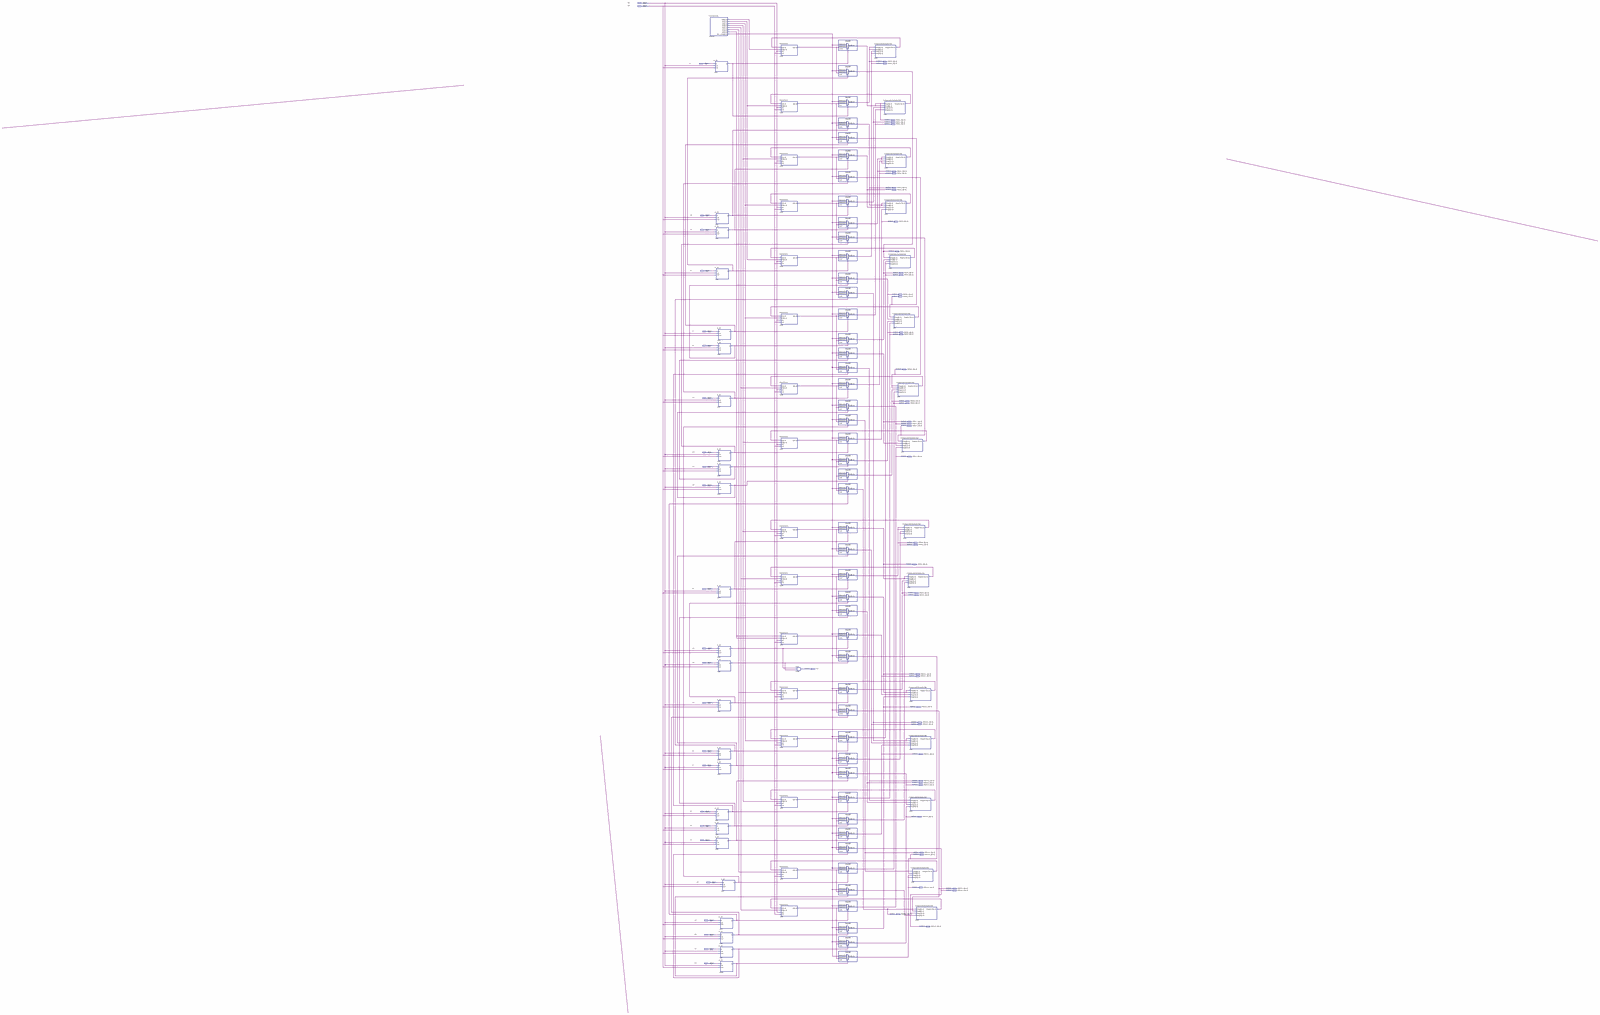
[diagram p0: schematic sheet, whole]
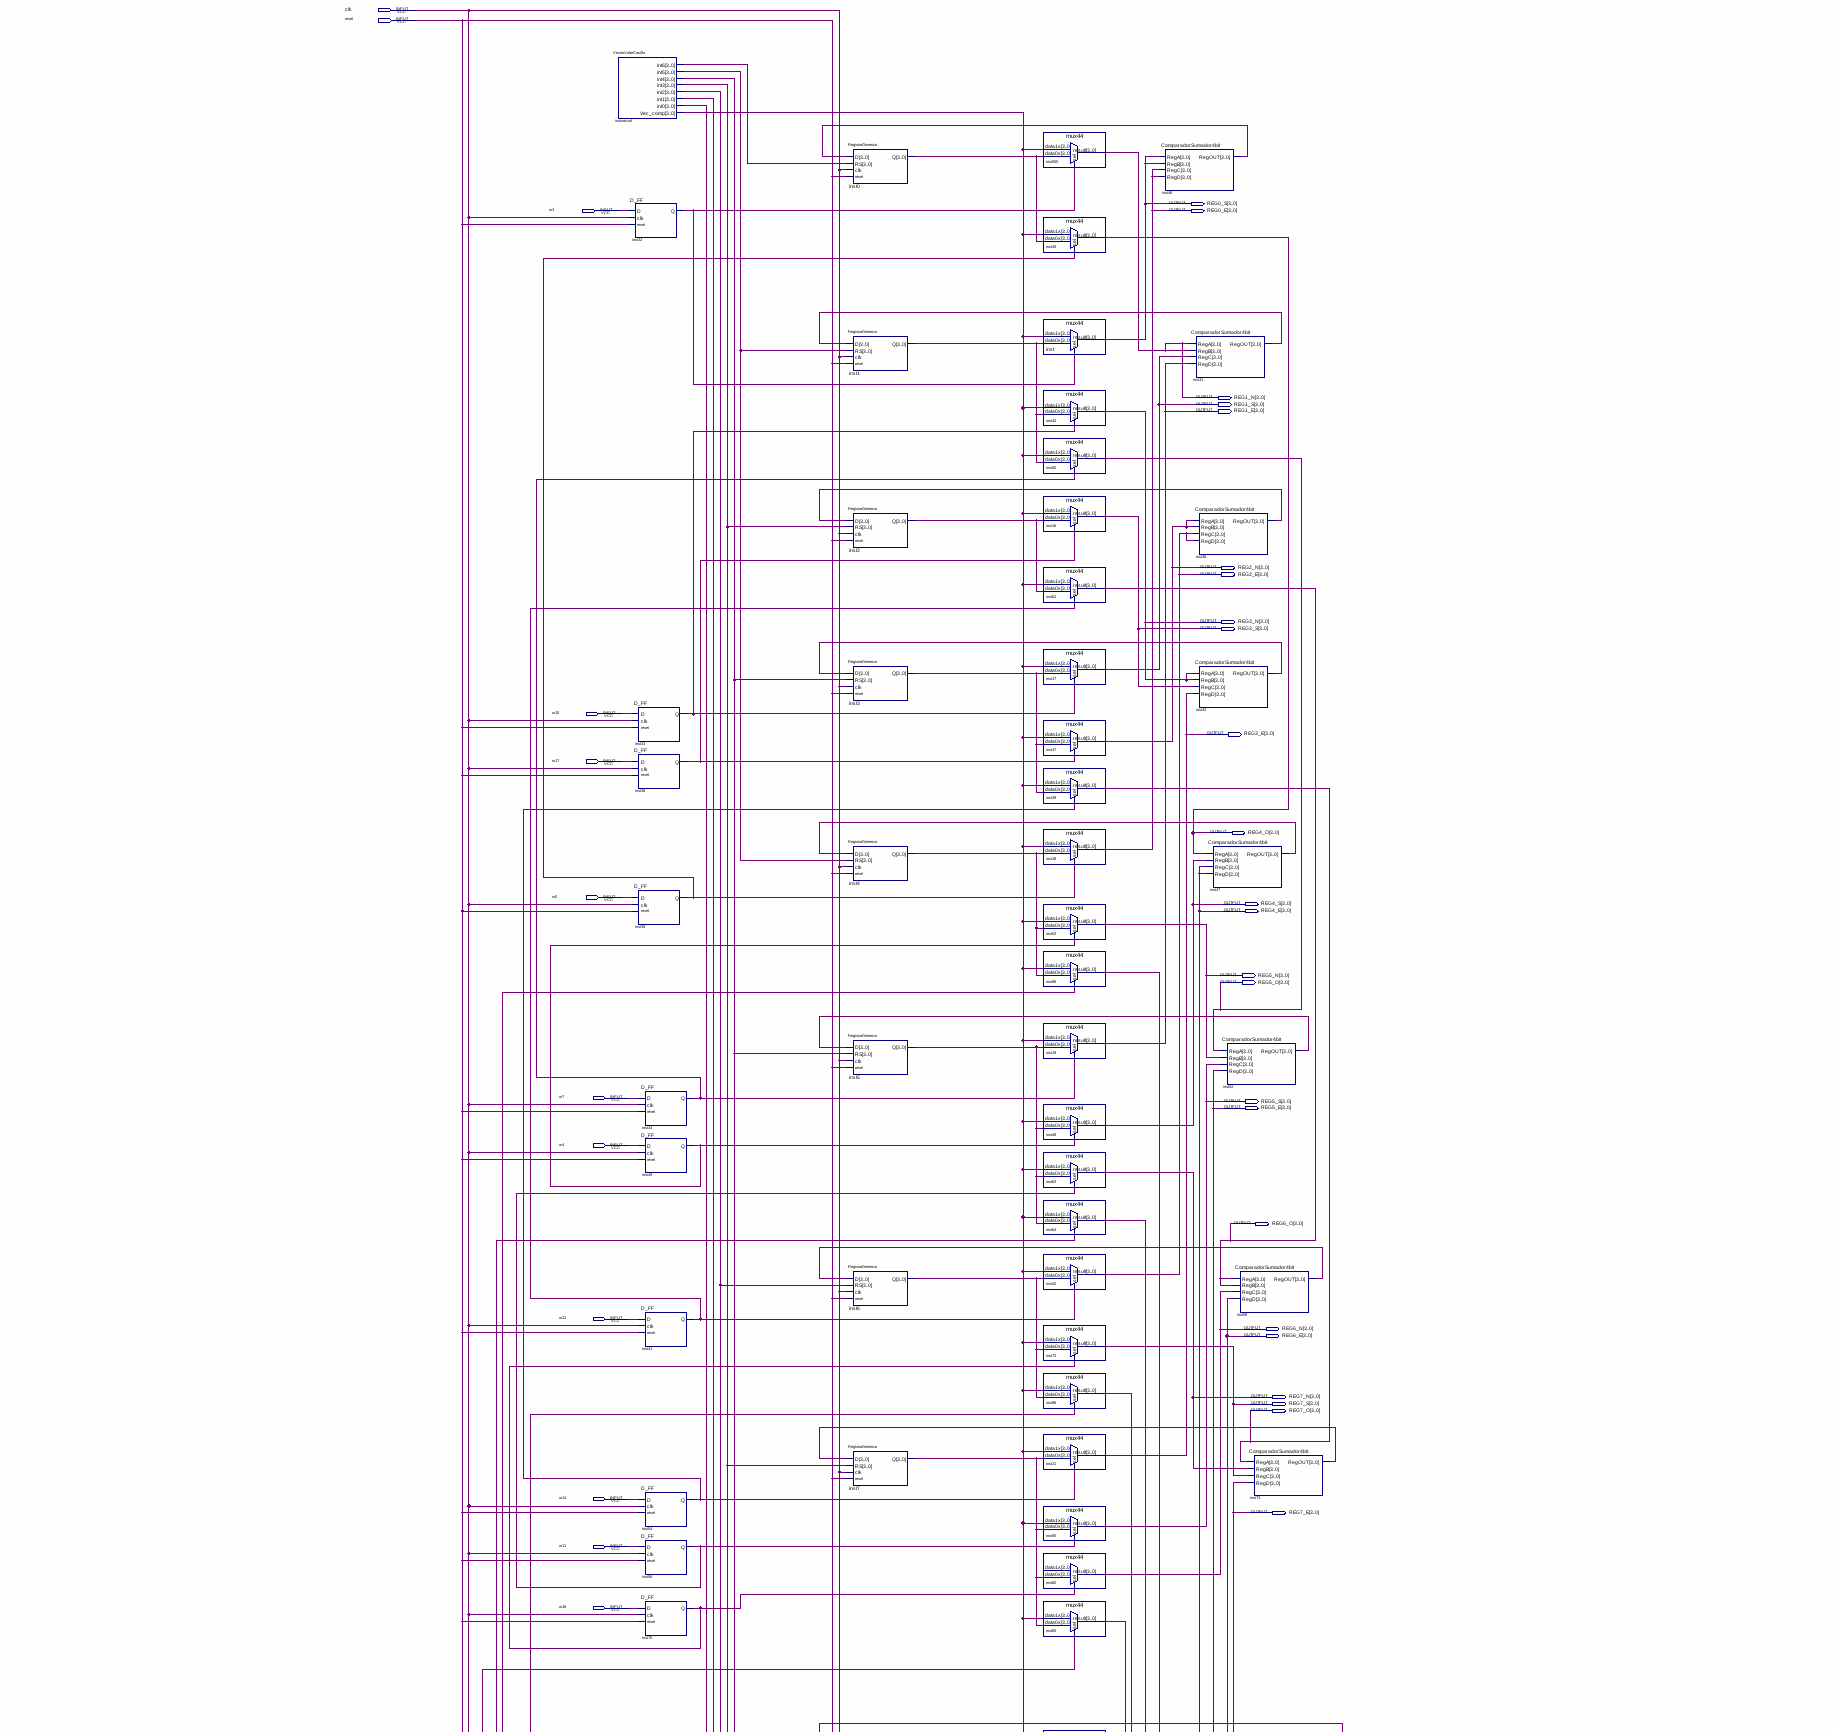
[diagram p1: schematic sheet, upper centre part]
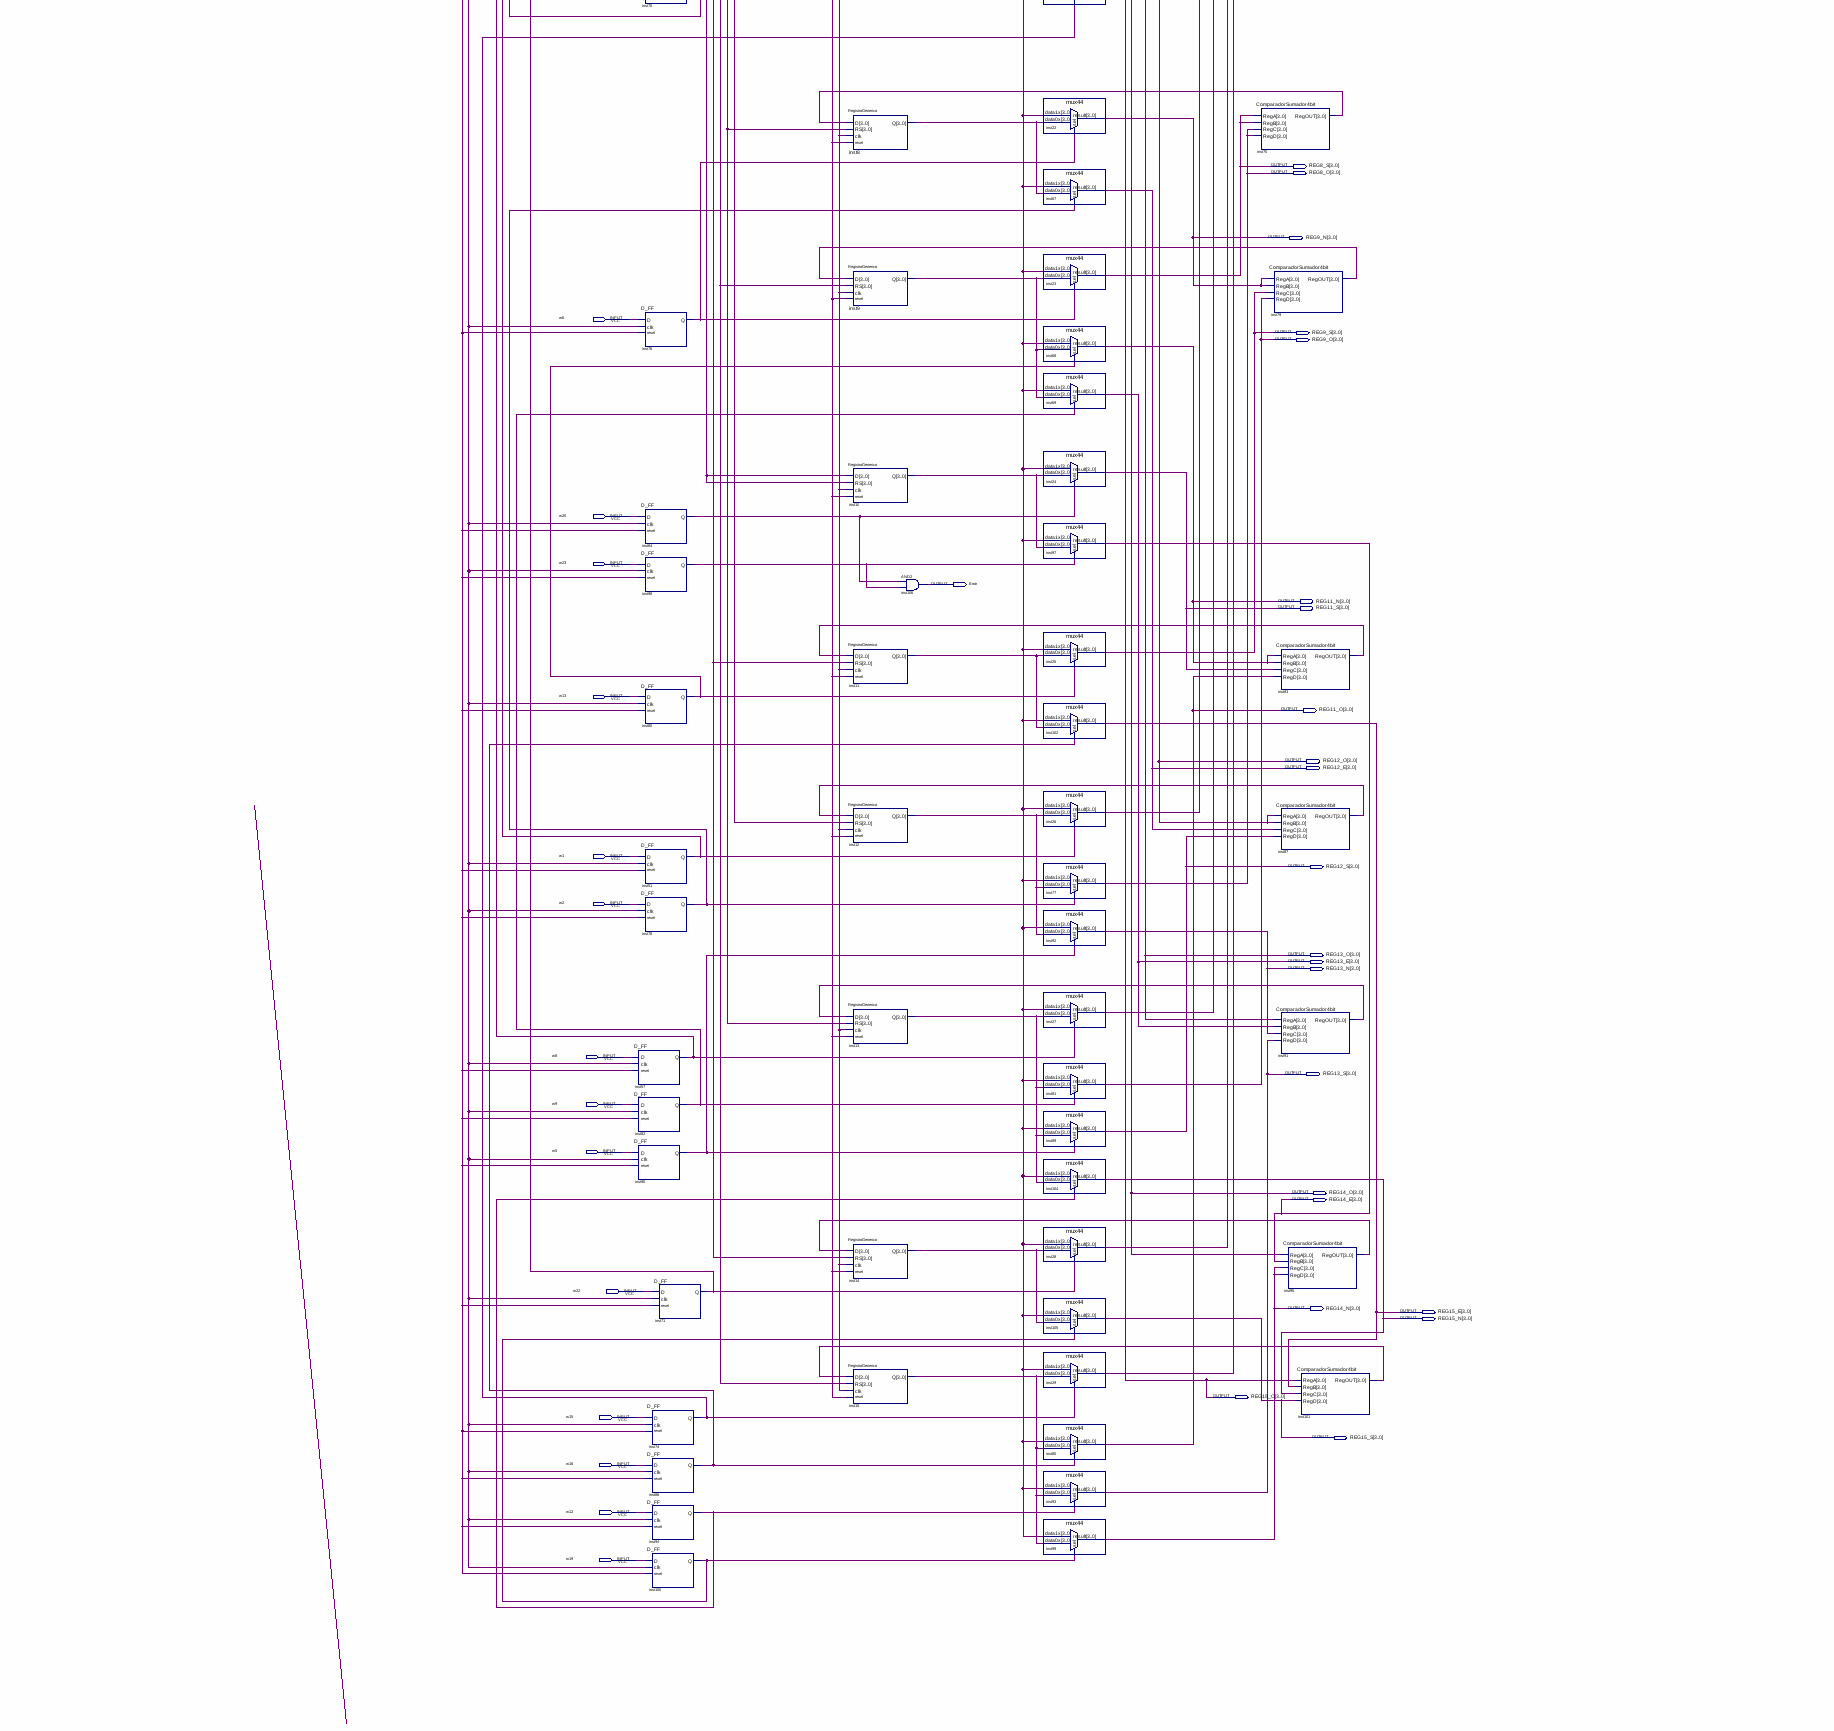
[diagram p2: schematic sheet, lower centre part]
// Quartus schematic testBlock.bdf as structural Verilog: 103 symbols, 73 pins
module testBlock (
  input  clk,
  input  reset,
  input  w3,
  input  w10,
  input  w17,
  input  w0,
  input  w7,
  input  w4,
  input  w21,
  input  w14,
  input  w11,
  input  w18,
  input  w6,
  input  w20,
  input  w23,
  input  w13,
  input  w1,
  input  w2,
  input  w8,
  input  w9,
  input  w5,
  input  w22,
  input  w15,
  input  w16,
  input  w12,
  input  w19,
  output [3:0] REG0_S,
  output [3:0] REG0_E,
  output [3:0] REG1_N,
  output [3:0] REG1_S,
  output [3:0] REG1_E,
  output [3:0] REG2_N,
  output [3:0] REG2_E,
  output [3:0] REG3_N,
  output [3:0] REG3_S,
  output [3:0] REG3_E,
  output [3:0] REG4_O,
  output [3:0] REG4_S,
  output [3:0] REG4_E,
  output [3:0] REG5_N,
  output [3:0] REG5_O,
  output [3:0] REG5_S,
  output [3:0] REG5_E,
  output [3:0] REG6_O,
  output [3:0] REG6_N,
  output [3:0] REG6_E,
  output [3:0] REG7_N,
  output [3:0] REG7_S,
  output [3:0] REG7_O,
  output [3:0] REG7_E,
  output [3:0] REG8_S,
  output [3:0] REG8_O,
  output [3:0] REG9_N,
  output [3:0] REG9_S,
  output [3:0] REG9_O,
  output Error,
  output [3:0] REG11_N,
  output [3:0] REG11_S,
  output [3:0] REG11_O,
  output [3:0] REG12_O,
  output [3:0] REG12_E,
  output [3:0] REG12_S,
  output [3:0] REG13_O,
  output [3:0] REG13_E,
  output [3:0] REG13_N,
  output [3:0] REG13_S,
  output [3:0] REG14_O,
  output [3:0] REG14_E,
  output [3:0] REG14_N,
  output [3:0] REG15_E,
  output [3:0] REG15_N,
  output [3:0] REG15_O,
  output [3:0] REG15_S
);

  wire inst32_q, inst33_q, inst34_q, inst35_q, inst38_q, inst41_q, inst49_q, inst51_q, inst54_q, inst56_q,
       inst57_q, inst70_q, inst71_q, inst74_q, inst76_q, inst78_q, inst80_q, inst82_q, inst84_q, inst86_q,
       inst90_q, inst94_q, inst98_q, inst100_q;
  wire [3:0] inst0_q, inst1_q, inst2_q, inst3_q, inst4_q, inst5_q, inst6_q, inst7_q, inst8_q, inst9_q,
       inst10_q, inst11_q, inst12_q, inst13_q, inst14_q, inst15_q, inst31_regout, inst36_regout,
       inst42_regout, inst46_regout, inst47_regout, inst52_regout, inst59_regout, inst73_regout,
       inst75_regout, inst79_regout, inst83_regout, inst87_regout, inst91_regout, inst95_regout,
       inst101_regout, instvecval_int0, instvecval_int1, instvecval_int2, instvecval_int3, instvecval_int4,
       instvecval_int5, instvecval_int6, instvecval_vec_comp;

  VectorValorCasilla instvecval (
    .int6(instvecval_int6), .int5(instvecval_int5), .int4(instvecval_int4), .int3(instvecval_int3),
    .int2(instvecval_int2), .int1(instvecval_int1), .int0(instvecval_int0), .Vec_comp(instvecval_vec_comp));
  D_FF inst32 (.D(w3), .clk(clk), .reset(reset), .Q(inst32_q));
  D_FF inst33 (.D(w10), .clk(clk), .reset(reset), .Q(inst33_q));
  D_FF inst38 (.D(w17), .clk(clk), .reset(reset), .Q(inst38_q));
  D_FF inst35 (.D(w0), .clk(clk), .reset(reset), .Q(inst35_q));
  D_FF inst34 (.D(w7), .clk(clk), .reset(reset), .Q(inst34_q));
  D_FF inst49 (.D(w4), .clk(clk), .reset(reset), .Q(inst49_q));
  D_FF inst41 (.D(w21), .clk(clk), .reset(reset), .Q(inst41_q));
  D_FF inst54 (.D(w14), .clk(clk), .reset(reset), .Q(inst54_q));
  D_FF inst56 (.D(w11), .clk(clk), .reset(reset), .Q(inst56_q));
  D_FF inst70 (.D(w18), .clk(clk), .reset(reset), .Q(inst70_q));
  D_FF inst76 (.D(w6), .clk(clk), .reset(reset), .Q(inst76_q));
  D_FF inst84 (.D(w20), .clk(clk), .reset(reset), .Q(inst84_q));
  D_FF inst98 (.D(w23), .clk(clk), .reset(reset), .Q(inst98_q));
  D_FF inst80 (.D(w13), .clk(clk), .reset(reset), .Q(inst80_q));
  D_FF inst51 (.D(w1), .clk(clk), .reset(reset), .Q(inst51_q));
  D_FF inst78 (.D(w2), .clk(clk), .reset(reset), .Q(inst78_q));
  D_FF inst57 (.D(w8), .clk(clk), .reset(reset), .Q(inst57_q));
  D_FF inst82 (.D(w9), .clk(clk), .reset(reset), .Q(inst82_q));
  D_FF inst90 (.D(w5), .clk(clk), .reset(reset), .Q(inst90_q));
  D_FF inst71 (.D(w22), .clk(clk), .reset(reset), .Q(inst71_q));
  D_FF inst74 (.D(w15), .clk(clk), .reset(reset), .Q(inst74_q));
  D_FF inst86 (.D(w16), .clk(clk), .reset(reset), .Q(inst86_q));
  D_FF inst94 (.D(w12), .clk(clk), .reset(reset), .Q(inst94_q));
  D_FF inst100 (.D(w19), .clk(clk), .reset(reset), .Q(inst100_q));
  RegistroGenerico inst0 (.D(inst46_regout), .RS(instvecval_int6), .clk(clk), .reset(reset), .Q(inst0_q));
  RegistroGenerico inst1 (.D(inst31_regout), .RS(instvecval_int5), .clk(clk), .reset(reset), .Q(inst1_q));
  RegistroGenerico inst2 (.D(inst36_regout), .RS(instvecval_int3), .clk(clk), .reset(reset), .Q(inst2_q));
  RegistroGenerico inst3 (.D(inst42_regout), .RS(instvecval_int4), .clk(clk), .reset(reset), .Q(inst3_q));
  RegistroGenerico inst4 (.D(inst47_regout), .RS(instvecval_int5), .clk(clk), .reset(reset), .Q(inst4_q));
  RegistroGenerico inst5 (.D(inst52_regout), .RS(instvecval_int4), .clk(clk), .reset(reset), .Q(inst5_q));
  RegistroGenerico inst6 (.D(inst59_regout), .RS(instvecval_int2), .clk(clk), .reset(reset), .Q(inst6_q));
  RegistroGenerico inst7 (.D(inst73_regout), .RS(instvecval_int3), .clk(clk), .reset(reset), .Q(inst7_q));
  RegistroGenerico inst8 (.D(inst75_regout), .RS(instvecval_int3), .clk(clk), .reset(reset), .Q(inst8_q));
  RegistroGenerico inst9 (.D(inst79_regout), .RS(instvecval_int2), .clk(clk), .reset(reset), .Q(inst9_q));
  RegistroGenerico inst10 (.D(instvecval_int0), .RS(instvecval_int0), .clk(clk), .reset(reset), .Q(inst10_q));
  RegistroGenerico inst11 (.D(inst83_regout), .RS(instvecval_int1), .clk(clk), .reset(reset), .Q(inst11_q));
  RegistroGenerico inst12 (.D(inst87_regout), .RS(instvecval_int4), .clk(clk), .reset(reset), .Q(inst12_q));
  RegistroGenerico inst13 (.D(inst91_regout), .RS(instvecval_int3), .clk(clk), .reset(reset), .Q(inst13_q));
  RegistroGenerico inst14 (.D(inst95_regout), .RS(instvecval_int1), .clk(clk), .reset(reset), .Q(inst14_q));
  RegistroGenerico inst15 (.D(inst101_regout), .RS(instvecval_int2), .clk(clk), .reset(reset), .Q(inst15_q));
  and inst106 (Error, inst84_q, inst98_q);
  mux44 inst555 (.data1x(instvecval_vec_comp), .data0x(inst0_q), .sel(inst32_q), .result(REG1_N));
  mux44 inst45 (.data1x(instvecval_vec_comp), .data0x(inst0_q), .sel(inst35_q), .result(REG4_O));
  mux44 inst (.data1x(instvecval_vec_comp), .data0x(inst1_q), .sel(inst32_q), .result(REG0_S));
  mux44 inst43 (.data1x(instvecval_vec_comp), .data0x(inst1_q), .sel(inst33_q), .result(REG3_N));
  mux44 inst50 (.data1x(instvecval_vec_comp), .data0x(inst1_q), .sel(inst34_q), .result(REG5_O));
  mux44 inst16 (.data1x(instvecval_vec_comp), .data0x(inst2_q), .sel(inst38_q), .result(REG3_S));
  mux44 inst61 (.data1x(instvecval_vec_comp), .data0x(inst2_q), .sel(inst41_q), .result(REG6_O));
  mux44 inst17 (.data1x(instvecval_vec_comp), .data0x(inst3_q), .sel(inst33_q), .result(REG1_S));
  mux44 inst37 (.data1x(instvecval_vec_comp), .data0x(inst3_q), .sel(inst38_q), .result(REG2_N));
  mux44 inst39 (.data1x(instvecval_vec_comp), .data0x(inst3_q), .sel(inst54_q), .result(REG7_O));
  mux44 inst18 (.data1x(instvecval_vec_comp), .data0x(inst4_q), .sel(inst35_q), .result(REG0_E));
  mux44 inst53 (.data1x(instvecval_vec_comp), .data0x(inst4_q), .sel(inst49_q), .result(REG5_N));
  mux44 inst88 (.data1x(instvecval_vec_comp), .data0x(inst4_q), .sel(inst51_q), .result(REG12_O));
  mux44 inst19 (.data1x(instvecval_vec_comp), .data0x(inst5_q), .sel(inst34_q), .result(REG1_E));
  mux44 inst48 (.data1x(instvecval_vec_comp), .data0x(inst5_q), .sel(inst49_q), .result(REG4_S));
  mux44 inst63 (.data1x(instvecval_vec_comp), .data0x(inst5_q), .sel(inst56_q), .result(REG7_N));
  mux44 inst64 (.data1x(instvecval_vec_comp), .data0x(inst5_q), .sel(inst57_q), .result(REG13_O));
  mux44 inst20 (.data1x(instvecval_vec_comp), .data0x(inst6_q), .sel(inst41_q), .result(REG2_E));
  mux44 inst72 (.data1x(instvecval_vec_comp), .data0x(inst6_q), .sel(inst70_q), .result(REG7_S));
  mux44 inst96 (.data1x(instvecval_vec_comp), .data0x(inst6_q), .sel(inst71_q), .result(REG14_O));
  mux44 inst21 (.data1x(instvecval_vec_comp), .data0x(inst7_q), .sel(inst54_q), .result(REG3_E));
  mux44 inst55 (.data1x(instvecval_vec_comp), .data0x(inst7_q), .sel(inst56_q), .result(REG5_S));
  mux44 inst60 (.data0x(inst7_q), .sel(inst70_q), .result(REG6_N));  // open: data1x
  mux44 inst65 (.data1x(instvecval_vec_comp), .data0x(inst7_q), .sel(inst74_q), .result(REG15_O));
  mux44 inst22 (.data1x(instvecval_vec_comp), .data0x(inst8_q), .sel(inst76_q), .result(REG9_N));
  mux44 inst67 (.data1x(instvecval_vec_comp), .data0x(inst8_q), .sel(inst78_q), .result(REG12_E));
  mux44 inst23 (.data1x(instvecval_vec_comp), .data0x(inst9_q), .sel(inst76_q), .result(REG8_S));
  mux44 inst68 (.data1x(instvecval_vec_comp), .data0x(inst9_q), .sel(inst80_q), .result(REG11_N));
  mux44 inst69 (.data1x(instvecval_vec_comp), .data0x(inst9_q), .sel(inst82_q), .result(REG13_E));
  mux44 inst24 (.data1x(instvecval_vec_comp), .data0x(inst10_q), .sel(inst84_q), .result(REG11_S));
  mux44 inst97 (.data1x(instvecval_vec_comp), .data0x(inst10_q), .sel(inst98_q), .result(REG14_E));
  mux44 inst25 (.data1x(instvecval_vec_comp), .data0x(inst11_q), .sel(inst80_q), .result(REG9_S));
  mux44 inst102 (.data1x(instvecval_vec_comp), .data0x(inst11_q), .sel(inst86_q), .result(REG15_E));
  mux44 inst26 (.data1x(instvecval_vec_comp), .data0x(inst12_q), .sel(inst51_q), .result(REG4_E));
  mux44 inst77 (.data1x(instvecval_vec_comp), .data0x(inst12_q), .sel(inst78_q), .result(REG8_O));
  mux44 inst92 (.data1x(instvecval_vec_comp), .data0x(inst12_q), .sel(inst90_q), .result(REG13_N));
  mux44 inst27 (.data1x(instvecval_vec_comp), .data0x(inst13_q), .sel(inst57_q), .result(REG5_E));
  mux44 inst81 (.data1x(instvecval_vec_comp), .data0x(inst13_q), .sel(inst82_q), .result(REG9_O));
  mux44 inst89 (.data1x(instvecval_vec_comp), .data0x(inst13_q), .sel(inst90_q), .result(REG12_S));
  mux44 inst104 (.data1x(instvecval_vec_comp), .data0x(inst13_q), .sel(inst94_q), .result(REG15_N));
  mux44 inst28 (.data1x(instvecval_vec_comp), .data0x(inst14_q), .sel(inst71_q), .result(REG6_E));
  mux44 inst105 (.data1x(instvecval_vec_comp), .data0x(inst14_q), .sel(inst100_q), .result(REG15_S));
  mux44 inst29 (.data1x(instvecval_vec_comp), .data0x(inst15_q), .sel(inst74_q), .result(REG7_E));
  mux44 inst85 (.data1x(instvecval_vec_comp), .data0x(inst15_q), .sel(inst86_q), .result(REG11_O));
  mux44 inst93 (.data1x(instvecval_vec_comp), .data0x(inst15_q), .sel(inst94_q), .result(REG13_S));
  mux44 inst99 (.data1x(instvecval_vec_comp), .data0x(inst15_q), .sel(inst100_q), .result(REG14_N));
  ComparadorSumador4bit inst46 (.RegA(REG0_S), .RegB(REG0_S), .RegC(REG0_E), .RegD(REG0_E), .RegOUT(inst46_regout));
  ComparadorSumador4bit inst31 (.RegA(REG1_N), .RegB(REG1_N), .RegC(REG1_S), .RegD(REG1_E), .RegOUT(inst31_regout));
  ComparadorSumador4bit inst36 (.RegA(REG2_N), .RegB(REG2_N), .RegC(REG2_E), .RegD(REG2_E), .RegOUT(inst36_regout));
  ComparadorSumador4bit inst42 (.RegA(REG3_N), .RegB(REG3_N), .RegC(REG3_S), .RegD(REG3_E), .RegOUT(inst42_regout));
  ComparadorSumador4bit inst47 (.RegA(REG4_O), .RegB(REG4_S), .RegC(REG4_E), .RegD(REG4_E), .RegOUT(inst47_regout));
  ComparadorSumador4bit inst52 (.RegA(REG5_O), .RegB(REG5_N), .RegC(REG5_S), .RegD(REG5_E), .RegOUT(inst52_regout));
  ComparadorSumador4bit inst59 (.RegA(REG6_O), .RegB(REG6_O), .RegC(REG6_N), .RegD(REG6_E), .RegOUT(inst59_regout));
  ComparadorSumador4bit inst73 (.RegA(REG7_O), .RegB(REG7_N), .RegC(REG7_S), .RegD(REG7_E), .RegOUT(inst73_regout));
  ComparadorSumador4bit inst75 (.RegA(REG8_S), .RegB(REG8_S), .RegC(REG8_O), .RegD(REG8_O), .RegOUT(inst75_regout));
  ComparadorSumador4bit inst79 (.RegA(REG9_N), .RegB(REG9_N), .RegC(REG9_S), .RegD(REG9_O), .RegOUT(inst79_regout));
  ComparadorSumador4bit inst83 (.RegA(REG11_N), .RegB(REG11_N), .RegC(REG11_S), .RegD(REG11_O), .RegOUT(inst83_regout));
  ComparadorSumador4bit inst87 (.RegA(REG12_O), .RegB(REG12_O), .RegC(REG12_E), .RegD(REG12_S), .RegOUT(inst87_regout));
  ComparadorSumador4bit inst91 (.RegA(REG13_O), .RegB(REG13_E), .RegC(REG13_N), .RegD(REG13_S), .RegOUT(inst91_regout));
  ComparadorSumador4bit inst95 (.RegA(REG14_O), .RegB(REG14_E), .RegC(REG14_N), .RegD(REG14_N), .RegOUT(inst95_regout));
  ComparadorSumador4bit inst101 (
    .RegA(REG15_O), .RegB(REG15_E), .RegC(REG15_N), .RegD(REG15_S), .RegOUT(inst101_regout));
endmodule
